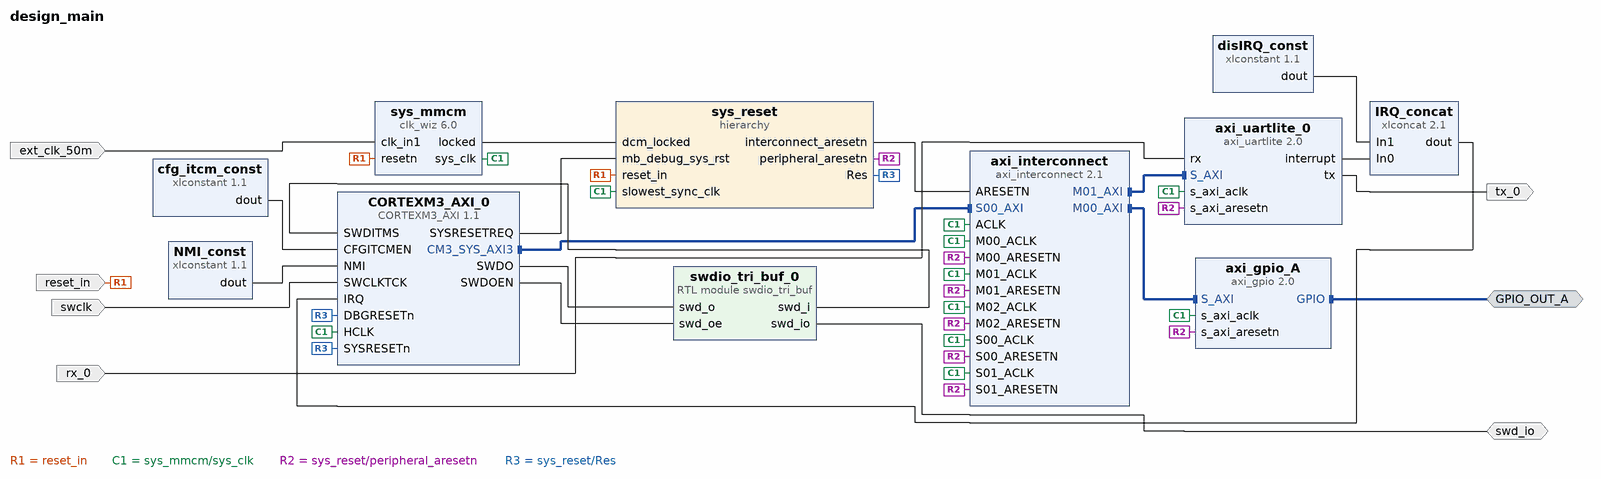
[diagram p0: block diagram of the top level]
# Vivado block design design_main, xc7k325tffg676-2, Vivado 2021.2
create_bd_design design_main

create_bd_intf_port -mode Master -vlnv xilinx.com:interface:gpio_rtl:1.0 GPIO_OUT_A
create_bd_port -dir I -type rst reset_in
set_property -dict {CONFIG.POLARITY ACTIVE_LOW} [get_bd_ports reset_in]
create_bd_port -dir I -type clk swclk
create_bd_port -dir IO swd_io
create_bd_port -dir I rx_0
create_bd_port -dir O tx_0
create_bd_port -dir I -type clk ext_clk_50m
set_property -dict {CONFIG.FREQ_HZ 50000000} [get_bd_ports ext_clk_50m]

create_bd_cell -type ip -vlnv Arm.com:CortexM:CORTEXM3_AXI:1.1 CORTEXM3_AXI_0
set_property -dict [list \
  CONFIG.DTCM_SIZE {"0111"} \
  CONFIG.ITCM_INIT_RAM false \
  CONFIG.ITCM_SIZE {"0111"} \
  CONFIG.JTAG_PRESENT false \
  CONFIG.LVL_WIDTH 3 \
  CONFIG.TRACE_LVL 1 \
  CONFIG.WIC_PRESENT false \
] [get_bd_cells CORTEXM3_AXI_0]
create_bd_cell -type module -reference swdio_tri_buf swdio_tri_buf_0
create_bd_cell -type ip -vlnv xilinx.com:ip:xlconstant:1.1 cfg_itcm_const
set_property -dict {CONFIG.CONST_WIDTH 2} [get_bd_cells cfg_itcm_const]
create_bd_cell -type ip -vlnv xilinx.com:ip:xlconstant:1.1 NMI_const
set_property -dict {CONFIG.CONST_VAL 0} [get_bd_cells NMI_const]
create_bd_cell -type ip -vlnv xilinx.com:ip:xlconcat:2.1 IRQ_concat
set_property -dict {CONFIG.IN1_WIDTH 15 CONFIG.NUM_PORTS 2} [get_bd_cells IRQ_concat]
create_bd_cell -type ip -vlnv xilinx.com:ip:xlconstant:1.1 disIRQ_const
set_property -dict {CONFIG.CONST_VAL 0 CONFIG.CONST_WIDTH 15} [get_bd_cells disIRQ_const]
create_bd_cell -type hier sys_reset
create_bd_cell -type ip -vlnv xilinx.com:ip:axi_gpio:2.0 axi_gpio_A
set_property -dict {CONFIG.C_ALL_OUTPUTS 1 CONFIG.C_GPIO_WIDTH 8} [get_bd_cells axi_gpio_A]
create_bd_cell -type ip -vlnv xilinx.com:ip:axi_interconnect:2.1 axi_interconnect
set_property -dict {CONFIG.NUM_MI 3 CONFIG.NUM_SI 2} [get_bd_cells axi_interconnect]
create_bd_cell -type ip -vlnv xilinx.com:ip:axi_uartlite:2.0 axi_uartlite_0
set_property -dict {CONFIG.C_S_AXI_ACLK_FREQ_HZ 50000000} [get_bd_cells axi_uartlite_0]
create_bd_cell -type ip -vlnv xilinx.com:ip:clk_wiz:6.0 sys_mmcm
set_property -dict [list \
  CONFIG.CLKIN1_JITTER_PS 200.0 \
  CONFIG.CLKOUT1_JITTER 192.113 \
  CONFIG.CLKOUT1_PHASE_ERROR 164.985 \
  CONFIG.CLKOUT1_REQUESTED_OUT_FREQ 50 \
  CONFIG.CLK_OUT1_PORT sys_clk \
  CONFIG.MMCM_CLKFBOUT_MULT_F 20.000 \
  CONFIG.MMCM_CLKIN1_PERIOD 20.000 \
  CONFIG.MMCM_CLKIN2_PERIOD 10.0 \
  CONFIG.MMCM_CLKOUT0_DIVIDE_F 20.000 \
  CONFIG.PRIM_IN_FREQ 50 \
  CONFIG.PRIM_SOURCE Single_ended_clock_capable_pin \
  CONFIG.RESET_PORT resetn \
  CONFIG.RESET_TYPE ACTIVE_LOW \
] [get_bd_cells sys_mmcm]

# ---- hierarchy /sys_reset ----
current_bd_instance /sys_reset
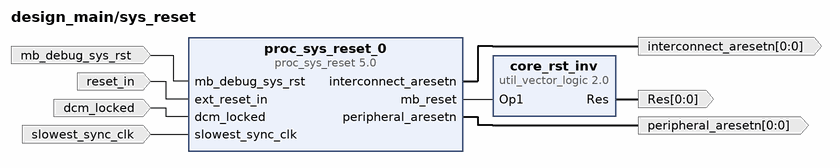
[diagram p1: block diagram inside /sys_reset]
create_bd_pin -dir I -type clk slowest_sync_clk
create_bd_pin -dir I -type rst reset_in
create_bd_pin -dir I -type rst mb_debug_sys_rst
create_bd_pin -dir I dcm_locked
create_bd_pin -dir O -from 0 -to 0 -type rst interconnect_aresetn
create_bd_pin -dir O -from 0 -to 0 -type rst peripheral_aresetn
create_bd_pin -dir O -from 0 -to 0 Res

create_bd_cell -type ip -vlnv xilinx.com:ip:proc_sys_reset:5.0 proc_sys_reset_0
create_bd_cell -type ip -vlnv xilinx.com:ip:util_vector_logic:2.0 core_rst_inv
set_property -dict {CONFIG.C_OPERATION not CONFIG.C_SIZE 1} [get_bd_cells core_rst_inv]

# ---- connections ----

current_bd_instance /sys_reset
connect_bd_net -net CORTEXM3_AXI_0_SYSRESETREQ [get_bd_pins mb_debug_sys_rst] [get_bd_pins proc_sys_reset_0/mb_debug_sys_rst]
connect_bd_net [get_bd_pins proc_sys_reset_0/interconnect_aresetn] [get_bd_pins interconnect_aresetn]
connect_bd_net [get_bd_pins proc_sys_reset_0/mb_reset] [get_bd_pins core_rst_inv/Op1]
connect_bd_net [get_bd_pins reset_in] [get_bd_pins proc_sys_reset_0/ext_reset_in]
connect_bd_net -net sys_mmcm_locked [get_bd_pins dcm_locked] [get_bd_pins proc_sys_reset_0/dcm_locked]
connect_bd_net -net sys_mmcm_sys_clk [get_bd_pins slowest_sync_clk] [get_bd_pins proc_sys_reset_0/slowest_sync_clk]
connect_bd_net -net sys_reset_peripheral_aresetn [get_bd_pins proc_sys_reset_0/peripheral_aresetn] [get_bd_pins peripheral_aresetn]
connect_bd_net -net util_vector_logic_0_Res [get_bd_pins core_rst_inv/Res] [get_bd_pins Res]

current_bd_instance /
connect_bd_intf_net [get_bd_intf_pins axi_interconnect/S00_AXI] [get_bd_intf_pins CORTEXM3_AXI_0/CM3_SYS_AXI3]
connect_bd_intf_net [get_bd_intf_ports GPIO_OUT_A] [get_bd_intf_pins axi_gpio_A/GPIO]
connect_bd_intf_net [get_bd_intf_pins axi_interconnect/M00_AXI] [get_bd_intf_pins axi_gpio_A/S_AXI]
connect_bd_intf_net [get_bd_intf_pins axi_interconnect/M01_AXI] [get_bd_intf_pins axi_uartlite_0/S_AXI]
connect_bd_net [get_bd_pins CORTEXM3_AXI_0/SWDO] [get_bd_pins swdio_tri_buf_0/swd_o]
connect_bd_net [get_bd_pins CORTEXM3_AXI_0/SWDOEN] [get_bd_pins swdio_tri_buf_0/swd_oe]
connect_bd_net [get_bd_pins CORTEXM3_AXI_0/SYSRESETREQ] [get_bd_pins sys_reset/mb_debug_sys_rst]
connect_bd_net [get_bd_ports swd_io] [get_bd_pins swdio_tri_buf_0/swd_io]
connect_bd_net -net SWCLKTCK_0_1 [get_bd_ports swclk] [get_bd_pins CORTEXM3_AXI_0/SWCLKTCK]
connect_bd_net [get_bd_pins axi_uartlite_0/interrupt] [get_bd_pins IRQ_concat/In0]
connect_bd_net [get_bd_pins axi_uartlite_0/tx] [get_bd_ports tx_0]
connect_bd_net [get_bd_ports ext_clk_50m] [get_bd_pins sys_mmcm/clk_in1]
connect_bd_net -net proc_sys_reset_0_interconnect_aresetn [get_bd_pins sys_reset/interconnect_aresetn] [get_bd_pins axi_interconnect/ARESETN]
connect_bd_net [get_bd_ports reset_in] [get_bd_pins sys_reset/reset_in] [get_bd_pins sys_mmcm/resetn]
connect_bd_net -net rx_0_1 [get_bd_ports rx_0] [get_bd_pins axi_uartlite_0/rx]
connect_bd_net [get_bd_pins swdio_tri_buf_0/swd_i] [get_bd_pins CORTEXM3_AXI_0/SWDITMS]
connect_bd_net [get_bd_pins sys_mmcm/locked] [get_bd_pins sys_reset/dcm_locked]
connect_bd_net [get_bd_pins sys_mmcm/sys_clk] \
  [get_bd_pins CORTEXM3_AXI_0/HCLK] [get_bd_pins sys_reset/slowest_sync_clk] [get_bd_pins axi_gpio_A/s_axi_aclk] \
  [get_bd_pins axi_interconnect/ACLK] [get_bd_pins axi_interconnect/S00_ACLK] [get_bd_pins axi_interconnect/M00_ACLK] \
  [get_bd_pins axi_interconnect/M01_ACLK] [get_bd_pins axi_interconnect/M02_ACLK] [get_bd_pins axi_interconnect/S01_ACLK] \
  [get_bd_pins axi_uartlite_0/s_axi_aclk]
connect_bd_net [get_bd_pins sys_reset/peripheral_aresetn] \
  [get_bd_pins axi_gpio_A/s_axi_aresetn] [get_bd_pins axi_interconnect/S00_ARESETN] \
  [get_bd_pins axi_interconnect/M00_ARESETN] [get_bd_pins axi_interconnect/M01_ARESETN] \
  [get_bd_pins axi_interconnect/M02_ARESETN] [get_bd_pins axi_interconnect/S01_ARESETN] \
  [get_bd_pins axi_uartlite_0/s_axi_aresetn]
connect_bd_net -net util_vector_logic_0_Res [get_bd_pins sys_reset/Res] [get_bd_pins CORTEXM3_AXI_0/SYSRESETn] [get_bd_pins CORTEXM3_AXI_0/DBGRESETn]
connect_bd_net -net xlconcat_0_dout [get_bd_pins IRQ_concat/dout] [get_bd_pins CORTEXM3_AXI_0/IRQ]
connect_bd_net -net xlconstant_0_dout [get_bd_pins cfg_itcm_const/dout] [get_bd_pins CORTEXM3_AXI_0/CFGITCMEN]
connect_bd_net -net xlconstant_0_dout1 [get_bd_pins NMI_const/dout] [get_bd_pins CORTEXM3_AXI_0/NMI]
connect_bd_net -net xlconstant_0_dout2 [get_bd_pins disIRQ_const/dout] [get_bd_pins IRQ_concat/In1]

# ---- address map ----
assign_bd_address -offset 0x40000000 -range 64K -target_address_space [get_bd_addr_spaces CORTEXM3_AXI_0/CM3_SYS_AXI3] [get_bd_addr_segs axi_gpio_A/S_AXI/Reg]
assign_bd_address -offset 0x40600000 -range 64K -target_address_space [get_bd_addr_spaces CORTEXM3_AXI_0/CM3_SYS_AXI3] [get_bd_addr_segs axi_uartlite_0/S_AXI/Reg]

validate_bd_design
save_bd_design
